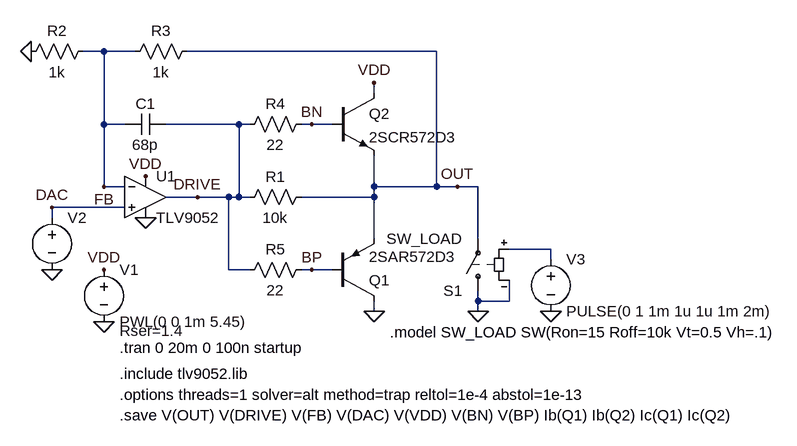
[diagram p0: schematic dac_buffer.asc]
dac_buffer.asc, the LTspice schematic file:
Version 4.1
SHEET 1 1508 680
WIRE 400 -176 368 -176
WIRE 448 -176 400 -176
WIRE 912 -176 528 -176
WIRE 816 -112 816 -128
WIRE 400 -64 400 -176
WIRE 432 -64 400 -64
WIRE 608 -64 496 -64
WIRE 624 -64 608 -64
WIRE 720 -64 704 -64
WIRE 752 -64 720 -64
WIRE 400 32 400 -64
WIRE 432 32 400 32
WIRE 816 32 816 -16
WIRE 912 32 912 -176
WIRE 912 32 816 32
WIRE 944 32 912 32
WIRE 976 32 944 32
WIRE 544 48 496 48
WIRE 592 48 544 48
WIRE 608 48 608 -64
WIRE 608 48 592 48
WIRE 624 48 608 48
WIRE 816 48 816 32
WIRE 816 48 704 48
WIRE 432 64 320 64
WIRE 320 80 320 64
WIRE 816 112 816 48
WIRE 976 112 976 32
WIRE 1088 128 1024 128
WIRE 1088 144 1088 128
WIRE 592 160 592 48
WIRE 624 160 592 160
WIRE 720 160 704 160
WIRE 752 160 720 160
WIRE 976 208 976 192
WIRE 1024 208 1024 176
WIRE 1024 208 976 208
WIRE 816 224 816 208
WIRE 976 224 976 208
FLAG 400 240 0
FLAG 320 160 0
FLAG 400 160 VDD
FLAG 464 16 VDD
FLAG 464 80 0
FLAG 816 224 0
FLAG 816 -128 VDD
FLAG 288 -176 0
FLAG 944 32 OUT
FLAG 544 48 DRIVE
FLAG 400 32 FB
FLAG 320 64 DAC
FLAG 720 -64 BN
FLAG 720 160 BP
FLAG 976 224 0
FLAG 1088 224 0
SYMBOL voltage 400 144 R0
WINDOW 123 0 0 Left 0
WINDOW 39 24 110 Left 2
SYMATTR SpiceLine Rser=1.4
SYMATTR InstName V1
SYMATTR Value PWL(0 0 1m 5.45)
SYMBOL voltage 320 64 R0
WINDOW 3 24 96 Invisible 2
WINDOW 123 0 0 Left 0
WINDOW 39 0 0 Left 0
SYMATTR Value SINE(1.25 1 100 0 0 -90)
SYMATTR InstName V2
SYMBOL OpAmps\\opamp2 464 -16 R0
SYMATTR InstName U1
SYMATTR Value TLV9052
SYMBOL pnp 752 208 M180
SYMATTR InstName Q1
SYMATTR Value 2SAR572D3
SYMBOL npn 752 -112 R0
SYMATTR InstName Q2
SYMATTR Value 2SCR572D3
SYMBOL res 720 -80 R90
WINDOW 0 0 56 VBottom 2
WINDOW 3 32 56 VTop 2
SYMATTR InstName R4
SYMATTR Value 22
SYMBOL res 720 144 R90
WINDOW 0 0 56 VBottom 2
WINDOW 3 32 56 VTop 2
SYMATTR InstName R5
SYMATTR Value 22
SYMBOL res 720 32 R90
WINDOW 0 0 56 VBottom 2
WINDOW 3 32 56 VTop 2
SYMATTR InstName R1
SYMATTR Value 10k
SYMBOL res 384 -192 R90
WINDOW 0 0 56 VBottom 2
WINDOW 3 32 56 VTop 2
SYMATTR InstName R2
SYMATTR Value 1k
SYMBOL res 544 -192 R90
WINDOW 0 0 56 VBottom 2
WINDOW 3 32 56 VTop 2
SYMATTR InstName R3
SYMATTR Value 1k
SYMBOL cap 496 -80 R90
WINDOW 0 0 32 VBottom 2
WINDOW 3 32 32 VTop 2
SYMATTR InstName C1
SYMATTR Value 68p
SYMBOL sw 976 208 R180
SYMATTR InstName S1
SYMATTR Value SW_LOAD
SYMBOL voltage 1088 128 R0
WINDOW 123 0 0 Left 0
WINDOW 39 0 0 Left 0
SYMATTR InstName V3
SYMATTR Value PULSE(0 1 1m 1u 1u 1m 2m)
TEXT 424 280 Left 2 !.tran 0 20m 0 100n startup
TEXT 424 352 Left 2 !.options threads=1 solver=alt method=trap reltol=1e-4 abstol=1e-13
TEXT 424 384 Left 2 !.save V(OUT) V(DRIVE) V(FB) V(DAC) V(VDD) V(BN) V(BP) Ib(Q1) Ib(Q2) Ic(Q1) Ic(Q2)
TEXT 424 320 Left 2 !.include tlv9052.lib
TEXT 840 256 Left 2 !.model SW_LOAD SW(Ron=15 Roff=10k Vt=0.5 Vh=.1)

The netlist it stands for:
* dac_buffer.asc
V1 VDD 0 PWL(0 0 1m 5.45) Rser=1.4
V2 DAC 0 SINE(1.25 1 100 0 0 -90)
X§U1 DAC FB VDD 0 DRIVE TLV9052  ; pins In+ In- V+ V- OUT
Q1 0 BP OUT 0 2SAR572D3
Q2 VDD BN OUT 0 2SCR572D3
R4 BN DRIVE 22
R5 BP DRIVE 22
R1 OUT DRIVE 10k
R2 FB 0 1k
R3 OUT FB 1k
C1 DRIVE FB 68p
S1 0 OUT N001 0 SW_LOAD
V3 N001 0 PULSE(0 1 1m 1u 1u 1m 2m)
.model NPN NPN
.model PNP PNP
.lib standard.bjt
.tran 0 20m 0 100n startup
.options threads=1 solver=alt method=trap reltol=1e-4 abstol=1e-13
.save V(OUT) V(DRIVE) V(FB) V(DAC) V(VDD) V(BN) V(BP) Ib(Q1) Ib(Q2) Ic(Q1) Ic(Q2)
.include tlv9052.lib
.model SW_LOAD SW(Ron=15 Roff=10k Vt=0.5 Vh=.1)
.backanno
.end